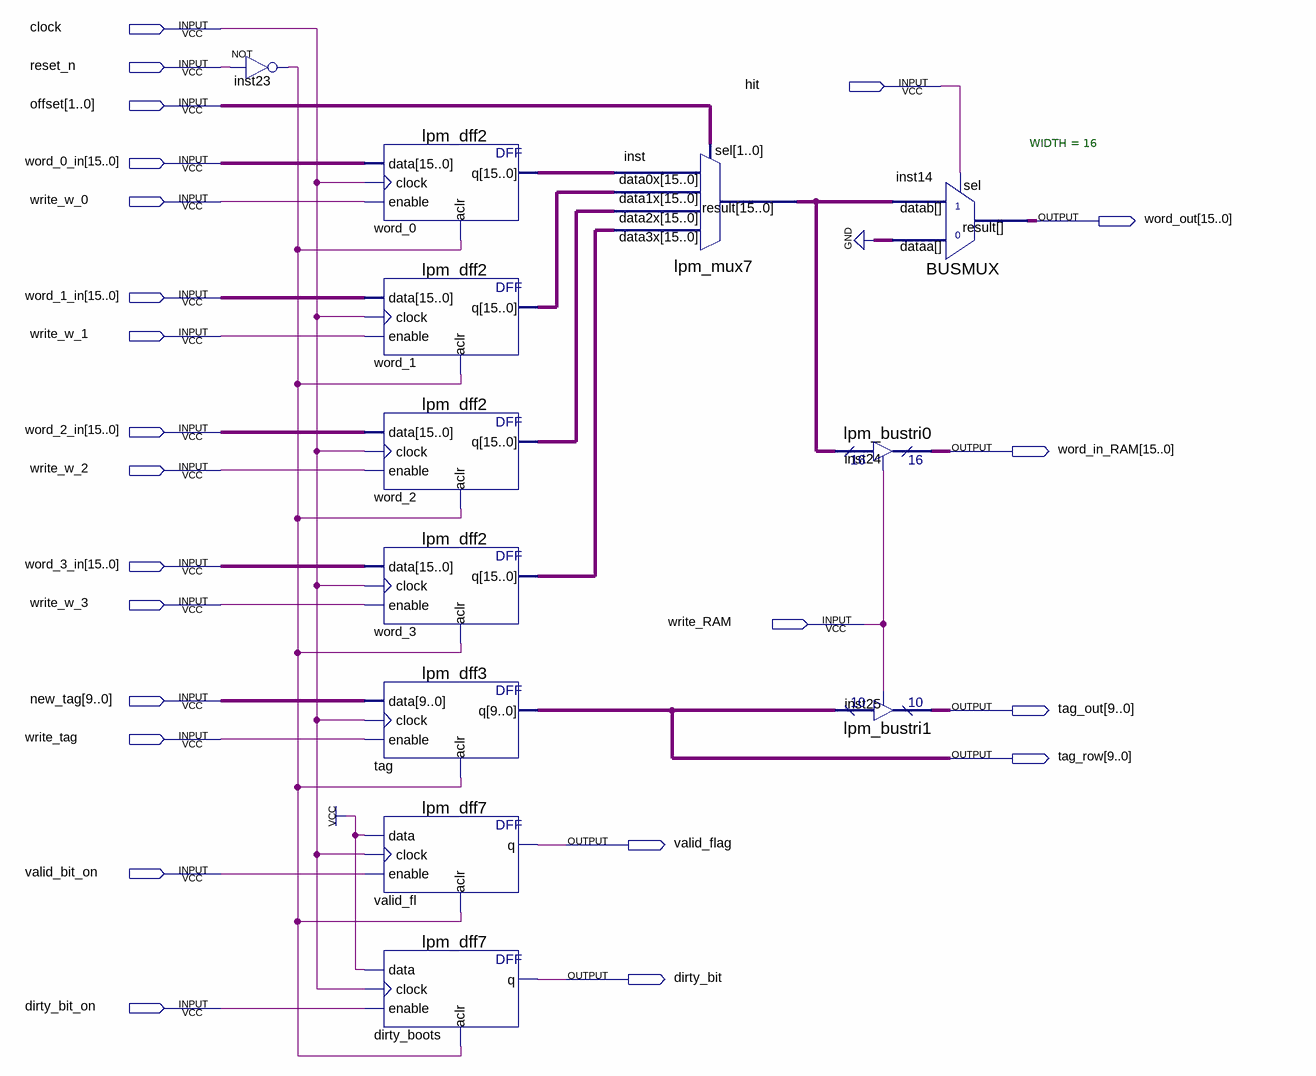
[diagram p0: schematic sheet]
// Quartus schematic cache_row_memory_unit.bdf as structural Verilog: 12 symbols, 23 pins
module cache_row_memory_unit (
  input  clock,
  input  reset_n,
  input  hit,
  input  [1:0] offset,
  input  [15:0] word_0_in,
  input  write_w_0,
  input  [15:0] word_1_in,
  input  write_w_1,
  input  [15:0] word_2_in,
  input  write_w_2,
  input  [15:0] word_3_in,
  input  write_w_3,
  input  write_RAM,
  input  [9:0] new_tag,
  input  write_tag,
  input  valid_bit_on,
  input  dirty_bit_on,
  output [15:0] word_out,
  output [15:0] word_in_RAM,
  output [9:0] tag_out,
  output [9:0] tag_row,
  output valid_flag,
  output dirty_bit
);

  wire inst23_out;
  wire [15:0] inst_result, word_0_q, word_1_q, word_2_q, word_3_q;

  not inst23 (inst23_out, reset_n);
  lpm_dff2 word_0 (.data(word_0_in), .clock(clock), .enable(write_w_0), .aclr(inst23_out), .q(word_0_q));
  lpm_dff2 word_1 (.data(word_1_in), .clock(clock), .enable(write_w_1), .aclr(inst23_out), .q(word_1_q));
  lpm_dff2 word_2 (.data(word_2_in), .clock(clock), .enable(write_w_2), .aclr(inst23_out), .q(word_2_q));
  lpm_dff2 word_3 (.data(word_3_in), .clock(clock), .enable(write_w_3), .aclr(inst23_out), .q(word_3_q));
  lpm_dff3 tag (.data(new_tag), .clock(clock), .enable(write_tag), .aclr(inst23_out), .q(tag_row));
  lpm_dff7 valid_fl (.data(1'b1), .clock(clock), .enable(valid_bit_on), .aclr(inst23_out), .q(valid_flag));
  lpm_dff7 dirty_boots (.data(1'b1), .clock(clock), .enable(dirty_bit_on), .aclr(inst23_out), .q(dirty_bit));
  lpm_mux7 inst (
    .data3x(word_3_q), .data2x(word_2_q), .data1x(word_1_q), .data0x(word_0_q), .sel(offset),
    .result(inst_result));
  lpm_bustri0 inst24 (.enabledt(write_RAM), .data(inst_result), .tridata(word_in_RAM));
  lpm_bustri1 inst25 (.enabledt(write_RAM), .data(tag_row), .tridata(tag_out));
  BUSMUX #(.WIDTH(16)) inst14 (.datab(inst_result), .sel(hit), .dataa({16{1'b0}}), .result(word_out));
endmodule
